# Altium project PCB_Project.PrjPcb (part 2 of 2)

## Sheet FPGA-Connector.SchDoc
size A2; Date: Date; CompanyName: HESSO; Engineer: Name; Address1: Route du Rawyl 47; Address2: 1950 Sion; Address3: Switzerland; ProjectName: Project Name
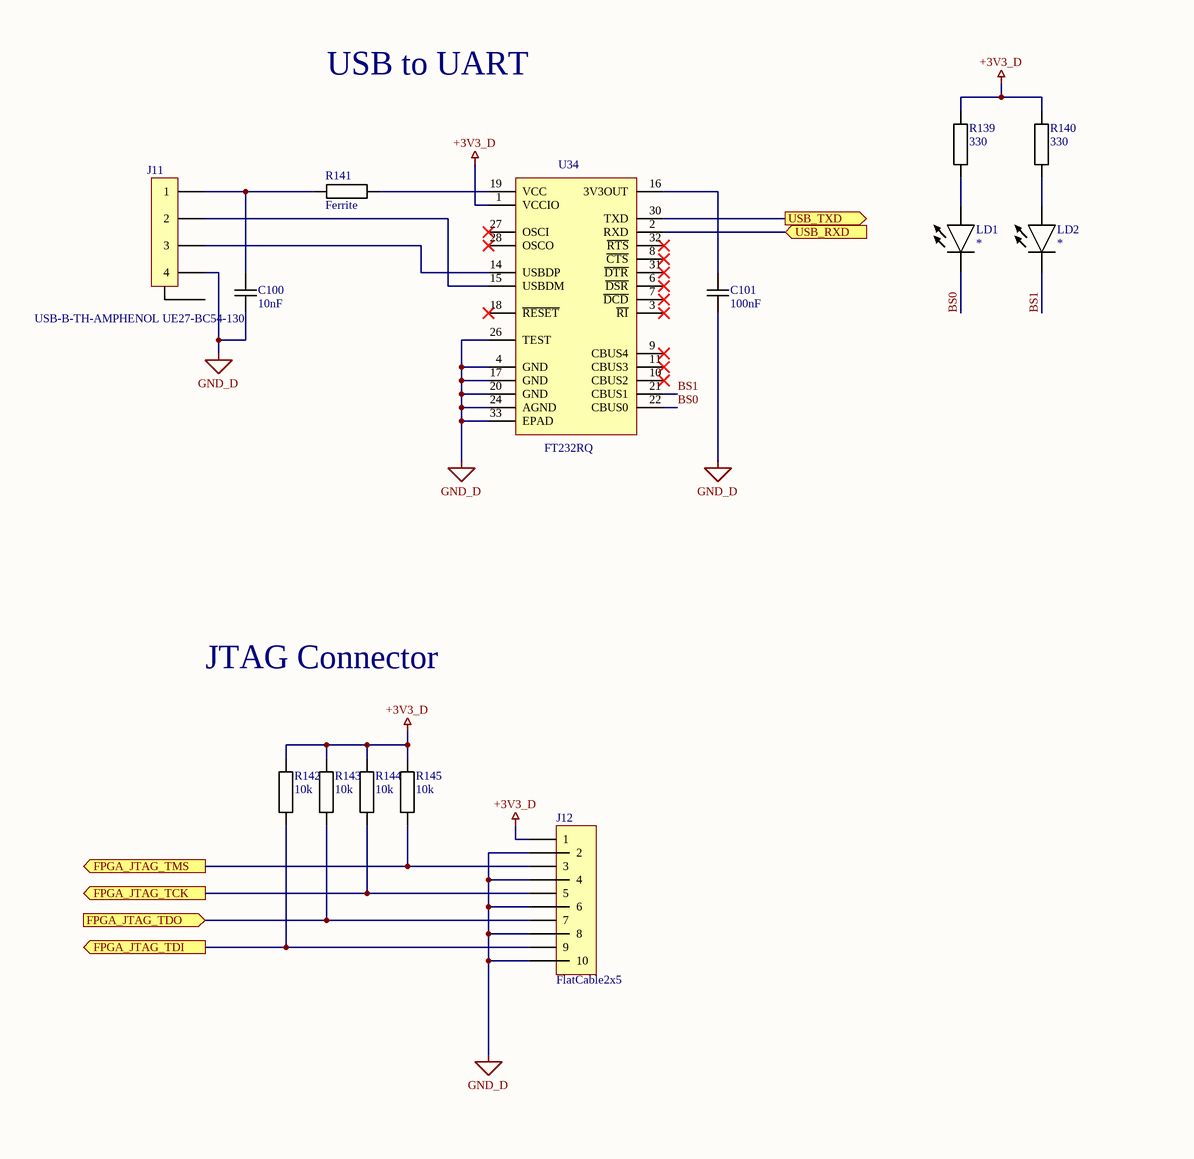
[diagram p10: FPGA-Connector.SchDoc, left]
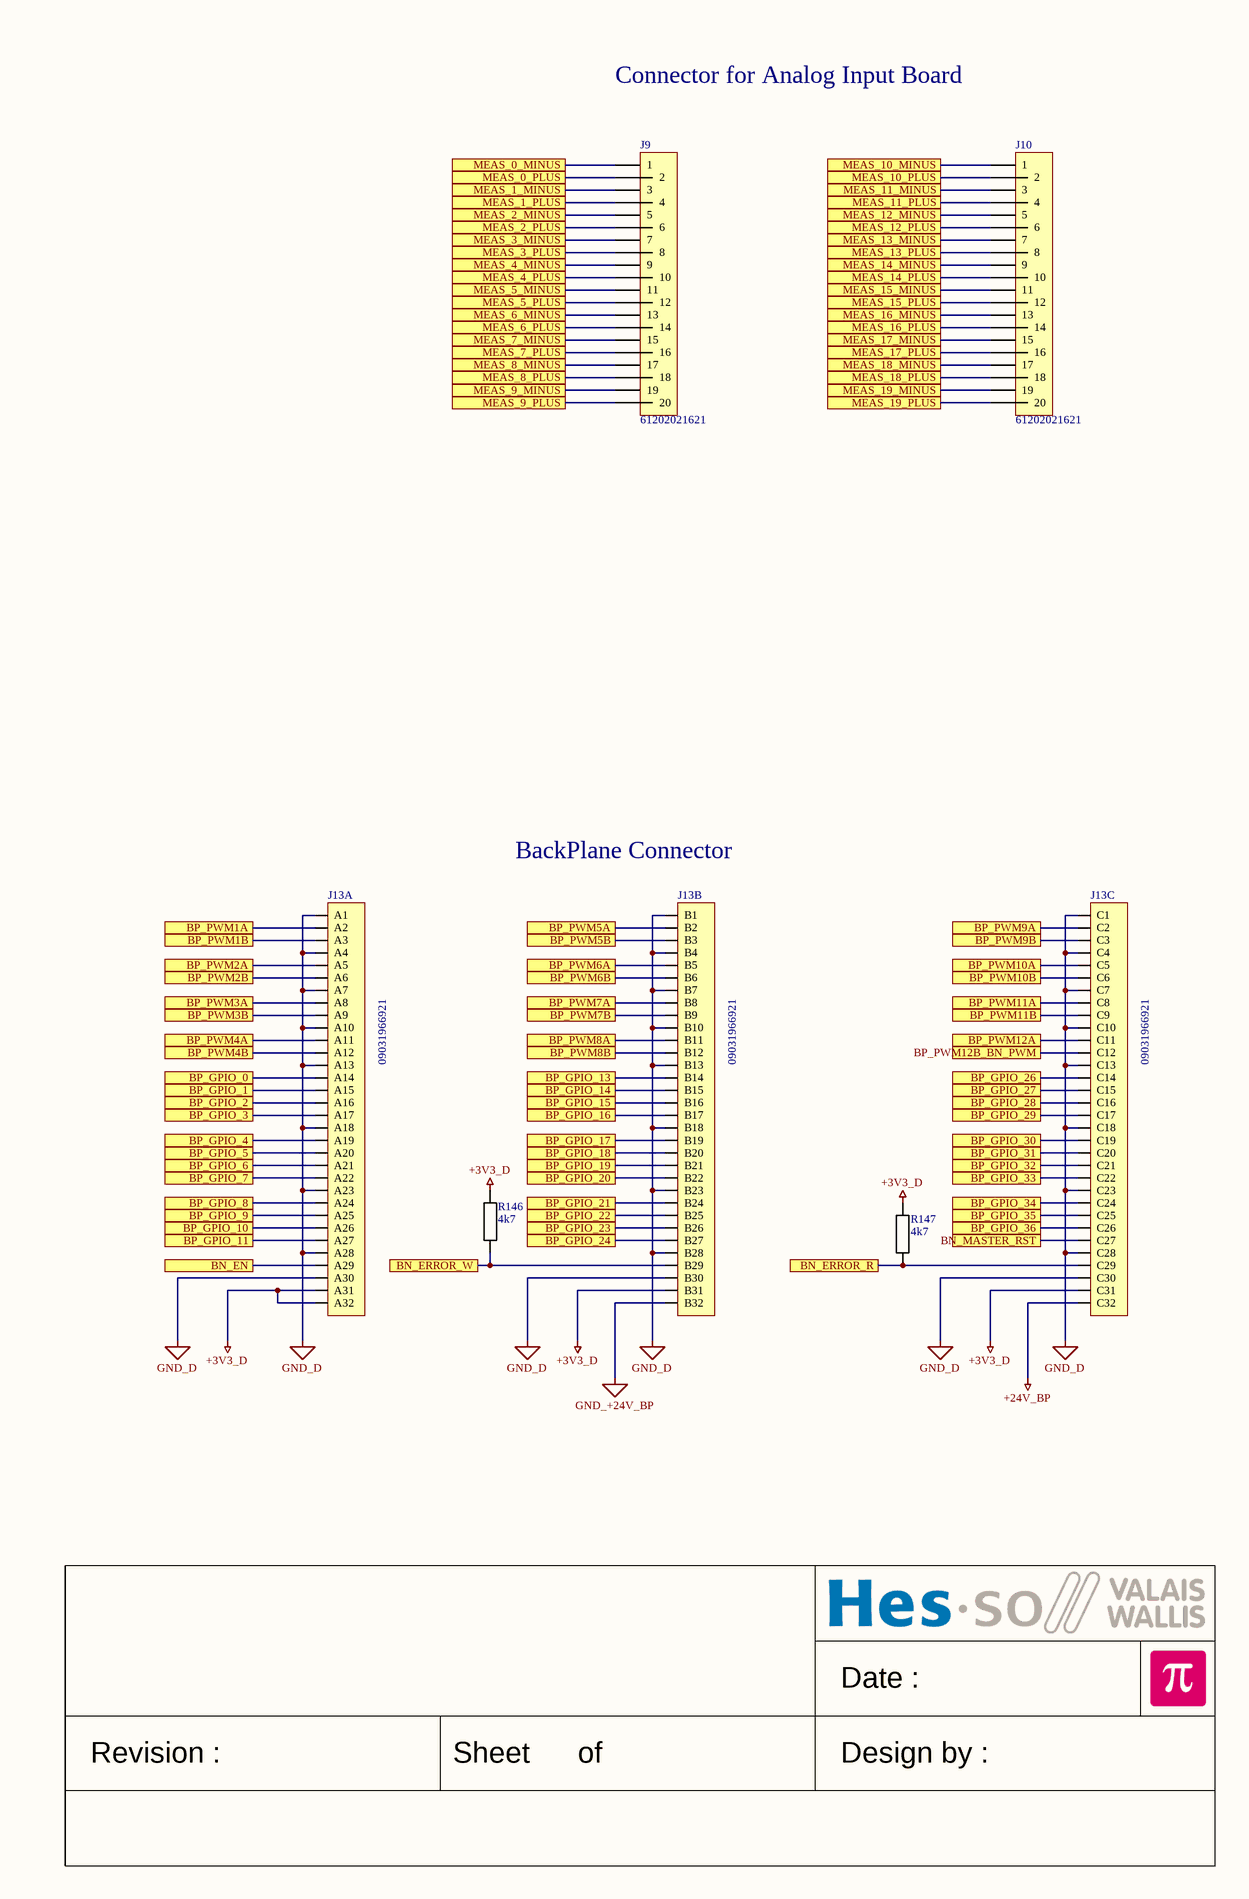
[diagram p11: FPGA-Connector.SchDoc, right]

### Parts
C100  10nF  [CAPACITOR 1608 REFLOW]
C101  100nF  [CAPACITOR 1608 REFLOW]
J9  61202021621  [FlatCable2x10 2.54MM Straight TH]
J10  61202021621  [FlatCable2x10 2.54MM Straight TH]
J11  USB-B-TH-AMPHENOL UE27-BC54-130  [USB-B TH AMPHENOL UE27-BC54-130]
J12  FlatCable2x5  [FlatCable2x5 2MM Straight TH FCI 98414-G06-10ULF]
J13  09031966921  [DIN41612 MALE 3X32 ABC R90]  (parts A,B,C of 3)
LD1  *  [LED 1608 REFLOW]
LD2  *  [LED 1608 REFLOW]
R139  330  [RESISTOR 2012 REFLOW]
R140  330  [RESISTOR 2012 REFLOW]
R141  Ferrite  [RESISTOR 1608 REFLOW]
R142  10k  [RESISTOR 1608 REFLOW]
R143  10k  [RESISTOR 1608 REFLOW]
R144  10k  [RESISTOR 1608 REFLOW]
R145  10k  [RESISTOR 1608 REFLOW]
R146  4k7  [RESISTOR 1608 REFLOW]
R147  4k7  [RESISTOR 1608 REFLOW]
U34  FT232RQ  [QFN32 P0.5 T3.2x3.2 C5.0X5.0 H1.0]

### Ports
BN_EN, BN_ERROR_R, BN_ERROR_W, BN_MASTER_RST, BP_GPIO_0, BP_GPIO_1, BP_GPIO_2, BP_GPIO_3, BP_GPIO_4, BP_GPIO_5, BP_GPIO_6, BP_GPIO_7, BP_GPIO_8, BP_GPIO_9, BP_GPIO_10, BP_GPIO_11, BP_GPIO_13, BP_GPIO_14, BP_GPIO_15, BP_GPIO_16, BP_GPIO_17, BP_GPIO_18, BP_GPIO_19, BP_GPIO_20, BP_GPIO_21, BP_GPIO_22, BP_GPIO_23, BP_GPIO_24, BP_GPIO_26, BP_GPIO_27, BP_GPIO_28, BP_GPIO_29, BP_GPIO_30, BP_GPIO_31, BP_GPIO_32, BP_GPIO_33, BP_GPIO_34, BP_GPIO_35, BP_GPIO_36, BP_PWM1A, BP_PWM1B, BP_PWM2A, BP_PWM2B, BP_PWM3A, BP_PWM3B, BP_PWM4A, BP_PWM4B, BP_PWM5A, BP_PWM5B, BP_PWM6A, BP_PWM6B, BP_PWM7A, BP_PWM7B, BP_PWM8A, BP_PWM8B, BP_PWM9A, BP_PWM9B, BP_PWM10A, BP_PWM10B, BP_PWM11A, BP_PWM11B, BP_PWM12A, BP_PWM12B_BN_PWM, FPGA_JTAG_TCK (out), FPGA_JTAG_TDI (out), FPGA_JTAG_TDO (in), FPGA_JTAG_TMS (out), MEAS_0_MINUS, MEAS_0_PLUS, MEAS_1_MINUS, MEAS_1_PLUS, MEAS_2_MINUS, MEAS_2_PLUS, MEAS_3_MINUS, MEAS_3_PLUS, MEAS_4_MINUS, MEAS_4_PLUS, MEAS_5_MINUS, MEAS_5_PLUS, MEAS_6_MINUS, MEAS_6_PLUS, MEAS_7_MINUS, MEAS_7_PLUS, MEAS_8_MINUS, MEAS_8_PLUS, MEAS_9_MINUS, MEAS_9_PLUS, MEAS_10_MINUS, MEAS_10_PLUS, MEAS_11_MINUS, MEAS_11_PLUS, MEAS_12_MINUS, MEAS_12_PLUS, MEAS_13_MINUS, MEAS_13_PLUS, MEAS_14_MINUS, MEAS_14_PLUS, MEAS_15_MINUS, MEAS_15_PLUS, MEAS_16_MINUS, MEAS_16_PLUS, MEAS_17_MINUS, MEAS_17_PLUS, MEAS_18_MINUS, MEAS_18_PLUS, MEAS_19_MINUS, MEAS_19_PLUS, USB_RXD (in), USB_TXD (out)

### Nets
+3V3_D: J12.1 J13.A31 J13.A32 J13.B31 J13.C31 R139.2 R140.2 R142.2 R143.2 R144.2 R145.2 R146.2 R147.2 U34.1(VCCIO)
+24V_BP: J13.C32
GND_+24V_BP: J13.B32
GND_D: C100.1 C101.1 J11.4 J12.2 J12.4 J12.6 J12.8 J12.10 J13.A1 J13.A4 J13.A7 J13.A10 J13.A13 J13.A18 J13.A23 J13.A28 J13.A30 J13.B1 J13.B4 J13.B7 J13.B10 J13.B13 J13.B18 J13.B23 J13.B28 J13.B30 J13.C1 J13.C4 J13.C7 J13.C10 J13.C13 J13.C18 J13.C23 J13.C28 J13.C30 U34.4(GND) U34.17(GND) U34.20(GND) U34.24(AGND) U34.26(TEST) U34.33(EPAD)
BS0: LD1.1(C) U34.22(CBUS0)
BS1: LD2.1(C) U34.21(CBUS1)
NetC100_2: C100.2 J11.1 R141.1
NetC101_2: C101.2 U34.16(3V3OUT)
NetJ9_1: J9.1 ; port MEAS_0_MINUS
NetJ9_2: J9.2 ; port MEAS_0_PLUS
NetJ9_3: J9.3 ; port MEAS_1_MINUS
NetJ9_4: J9.4 ; port MEAS_1_PLUS
NetJ9_5: J9.5 ; port MEAS_2_MINUS
NetJ9_6: J9.6 ; port MEAS_2_PLUS
NetJ9_7: J9.7 ; port MEAS_3_MINUS
NetJ9_8: J9.8 ; port MEAS_3_PLUS
NetJ9_9: J9.9 ; port MEAS_4_MINUS
NetJ9_10: J9.10 ; port MEAS_4_PLUS
NetJ9_11: J9.11 ; port MEAS_5_MINUS
NetJ9_12: J9.12 ; port MEAS_5_PLUS
NetJ9_13: J9.13 ; port MEAS_6_MINUS
NetJ9_14: J9.14 ; port MEAS_6_PLUS
NetJ9_15: J9.15 ; port MEAS_7_MINUS
NetJ9_16: J9.16 ; port MEAS_7_PLUS
NetJ9_17: J9.17 ; port MEAS_8_MINUS
NetJ9_18: J9.18 ; port MEAS_8_PLUS
NetJ9_19: J9.19 ; port MEAS_9_MINUS
NetJ9_20: J9.20 ; port MEAS_9_PLUS
NetJ10_1: J10.1 ; port MEAS_10_MINUS
NetJ10_2: J10.2 ; port MEAS_10_PLUS
NetJ10_3: J10.3 ; port MEAS_11_MINUS
NetJ10_4: J10.4 ; port MEAS_11_PLUS
NetJ10_5: J10.5 ; port MEAS_12_MINUS
NetJ10_6: J10.6 ; port MEAS_12_PLUS
NetJ10_7: J10.7 ; port MEAS_13_MINUS
NetJ10_8: J10.8 ; port MEAS_13_PLUS
NetJ10_9: J10.9 ; port MEAS_14_MINUS
NetJ10_10: J10.10 ; port MEAS_14_PLUS
NetJ10_11: J10.11 ; port MEAS_15_MINUS
NetJ10_12: J10.12 ; port MEAS_15_PLUS
NetJ10_13: J10.13 ; port MEAS_16_MINUS
NetJ10_14: J10.14 ; port MEAS_16_PLUS
NetJ10_15: J10.15 ; port MEAS_17_MINUS
NetJ10_16: J10.16 ; port MEAS_17_PLUS
NetJ10_17: J10.17 ; port MEAS_18_MINUS
NetJ10_18: J10.18 ; port MEAS_18_PLUS
NetJ10_19: J10.19 ; port MEAS_19_MINUS
NetJ10_20: J10.20 ; port MEAS_19_PLUS
NetJ11_2: J11.2 U34.15(USBDM)
NetJ11_3: J11.3 U34.14(USBDP)
NetJ11_5: J11.5 J11.6
NetJ12_3: J12.3 R145.1 ; port FPGA_JTAG_TMS
NetJ12_5: J12.5 R144.1 ; port FPGA_JTAG_TCK
NetJ12_7: J12.7 R143.1 ; port FPGA_JTAG_TDO
NetJ12_9: J12.9 R142.1 ; port FPGA_JTAG_TDI
NetJ13_A2: J13.A2 ; port BP_PWM1A
NetJ13_A3: J13.A3 ; port BP_PWM1B
NetJ13_A5: J13.A5 ; port BP_PWM2A
NetJ13_A6: J13.A6 ; port BP_PWM2B
NetJ13_A8: J13.A8 ; port BP_PWM3A
NetJ13_A9: J13.A9 ; port BP_PWM3B
NetJ13_A11: J13.A11 ; port BP_PWM4A
NetJ13_A12: J13.A12 ; port BP_PWM4B
NetJ13_A14: J13.A14 ; port BP_GPIO_0
NetJ13_A15: J13.A15 ; port BP_GPIO_1
NetJ13_A16: J13.A16 ; port BP_GPIO_2
NetJ13_A17: J13.A17 ; port BP_GPIO_3
NetJ13_A19: J13.A19 ; port BP_GPIO_4
NetJ13_A20: J13.A20 ; port BP_GPIO_5
NetJ13_A21: J13.A21 ; port BP_GPIO_6
NetJ13_A22: J13.A22 ; port BP_GPIO_7
NetJ13_A24: J13.A24 ; port BP_GPIO_8
NetJ13_A25: J13.A25 ; port BP_GPIO_9
NetJ13_A26: J13.A26 ; port BP_GPIO_10
NetJ13_A27: J13.A27 ; port BP_GPIO_11
NetJ13_A29: J13.A29 ; port BN_EN
NetJ13_B2: J13.B2 ; port BP_PWM5A
NetJ13_B3: J13.B3 ; port BP_PWM5B
NetJ13_B5: J13.B5 ; port BP_PWM6A
NetJ13_B6: J13.B6 ; port BP_PWM6B
NetJ13_B8: J13.B8 ; port BP_PWM7A
NetJ13_B9: J13.B9 ; port BP_PWM7B
NetJ13_B11: J13.B11 ; port BP_PWM8A
NetJ13_B12: J13.B12 ; port BP_PWM8B
NetJ13_B14: J13.B14 ; port BP_GPIO_13
NetJ13_B15: J13.B15 ; port BP_GPIO_14
NetJ13_B16: J13.B16 ; port BP_GPIO_15
NetJ13_B17: J13.B17 ; port BP_GPIO_16
NetJ13_B19: J13.B19 ; port BP_GPIO_17
NetJ13_B20: J13.B20 ; port BP_GPIO_18
NetJ13_B21: J13.B21 ; port BP_GPIO_19
NetJ13_B22: J13.B22 ; port BP_GPIO_20
NetJ13_B24: J13.B24 ; port BP_GPIO_21
NetJ13_B25: J13.B25 ; port BP_GPIO_22
NetJ13_B26: J13.B26 ; port BP_GPIO_23
NetJ13_B27: J13.B27 ; port BP_GPIO_24
NetJ13_B29: J13.B29 R146.1 ; port BN_ERROR_W
NetJ13_C2: J13.C2 ; port BP_PWM9A
NetJ13_C3: J13.C3 ; port BP_PWM9B
NetJ13_C5: J13.C5 ; port BP_PWM10A
NetJ13_C6: J13.C6 ; port BP_PWM10B
NetJ13_C8: J13.C8 ; port BP_PWM11A
NetJ13_C9: J13.C9 ; port BP_PWM11B
NetJ13_C11: J13.C11 ; port BP_PWM12A
NetJ13_C12: J13.C12 ; port BP_PWM12B_BN_PWM
NetJ13_C14: J13.C14 ; port BP_GPIO_26
NetJ13_C15: J13.C15 ; port BP_GPIO_27
NetJ13_C16: J13.C16 ; port BP_GPIO_28
NetJ13_C17: J13.C17 ; port BP_GPIO_29
NetJ13_C19: J13.C19 ; port BP_GPIO_30
NetJ13_C20: J13.C20 ; port BP_GPIO_31
NetJ13_C21: J13.C21 ; port BP_GPIO_32
NetJ13_C22: J13.C22 ; port BP_GPIO_33
NetJ13_C24: J13.C24 ; port BP_GPIO_34
NetJ13_C25: J13.C25 ; port BP_GPIO_35
NetJ13_C26: J13.C26 ; port BP_GPIO_36
NetJ13_C27: J13.C27 ; port BN_MASTER_RST
NetJ13_C29: J13.C29 R147.1 ; port BN_ERROR_R
NetLD1_2: LD1.2(A) R139.1
NetLD2_2: LD2.2(A) R140.1
NetR141_2: R141.2 U34.19(VCC)
NetU34_2: U34.2(RXD) ; port USB_RXD
NetU34_30: U34.30(TXD) ; port USB_TXD

Not connected (* = marked no-connect by the designer): U34 3(~{RI})* 5 6(~{DSR})* 7(~{DCD})* 8(~{CTS})* 9(CBUS4)* 10(CBUS2)* 11(CBUS3)* 12 13 18(~{RESET})* 23 25 27(OSCI)* 28(OSCO)* 29 31(~{DTR})* 32(~{RTS})*

### Notes on the sheet
- USB to UART
- Connector for Analog Input Board
- JTAG Connector
- BackPlane Connector
- Date :
- Revision :
- Sheet
- of
- Design by :

### Library data of the parts
C100 C101 = Capacitor: Capacitor X7R 10% 50V 1608(0603)
  C100: Value: 10nF
  C101: Value: 100nF
J9 J10 = FlatCable2x10: Manufacturer: Wurth Elektronik; Mouser No.: 710-61202021621; Value: 61202021621
J13 = DIN41612 MALE 3X32 ABC R90: Manufacturer: Harting; Mouser No.: 617-09-03-196-6921; Value: 09031966921
LD1 LD2 = LED: LED generic; Value: *
R139 R140 = Resistor: Resistor 1% 50V 125mW 2012(0805); Value: 330
R141-R147 = Resistor: Resistor 1% 50V 100mW 1608(0603)
  R141: Value: Ferrite
  R142-R145: Value: 10k
  R146 R147: Value: 4k7
U34 = FT232RQ: 24-Bit ADC with Ultra Low Noise PGIA - Crystal; Value: FT232RQ

## Sheet FPGA-Supply.SchDoc
size A2; Date: Date; CompanyName: HESSO; Engineer: Name; Address1: Route du Rawyl 47; Address2: 1950 Sion; Address3: Switzerland; ProjectName: Project Name
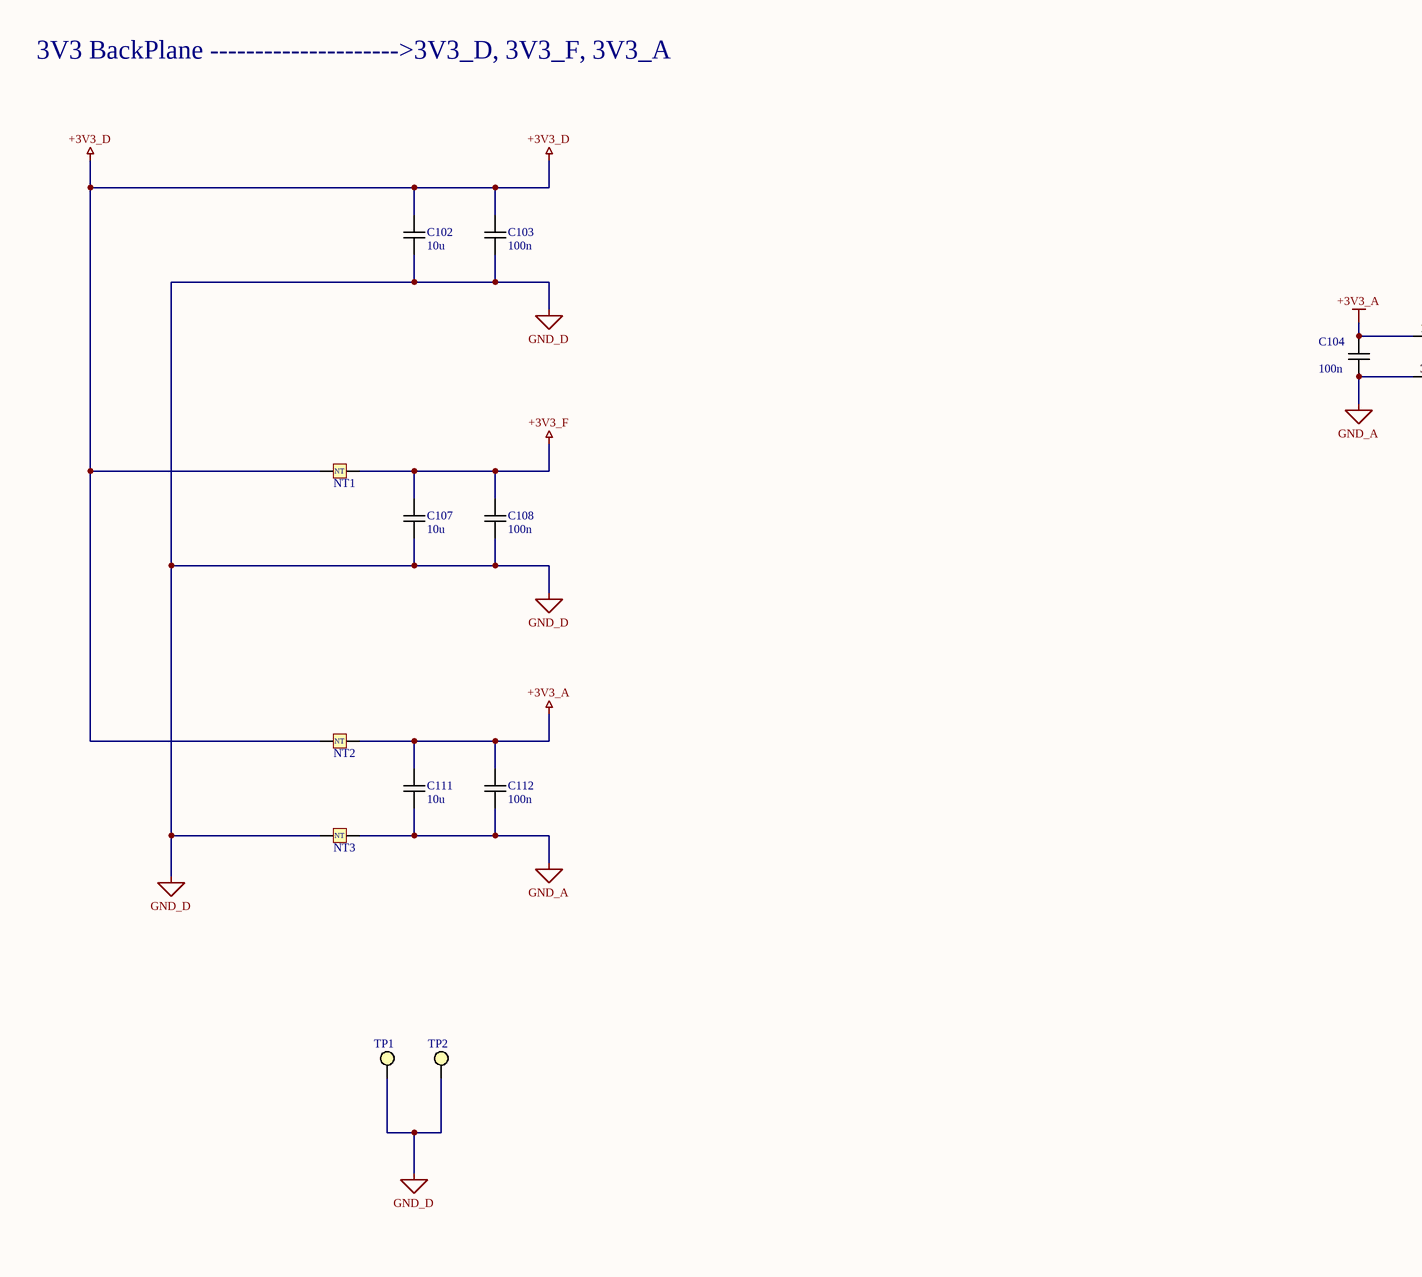
[diagram p12: FPGA-Supply.SchDoc, left]
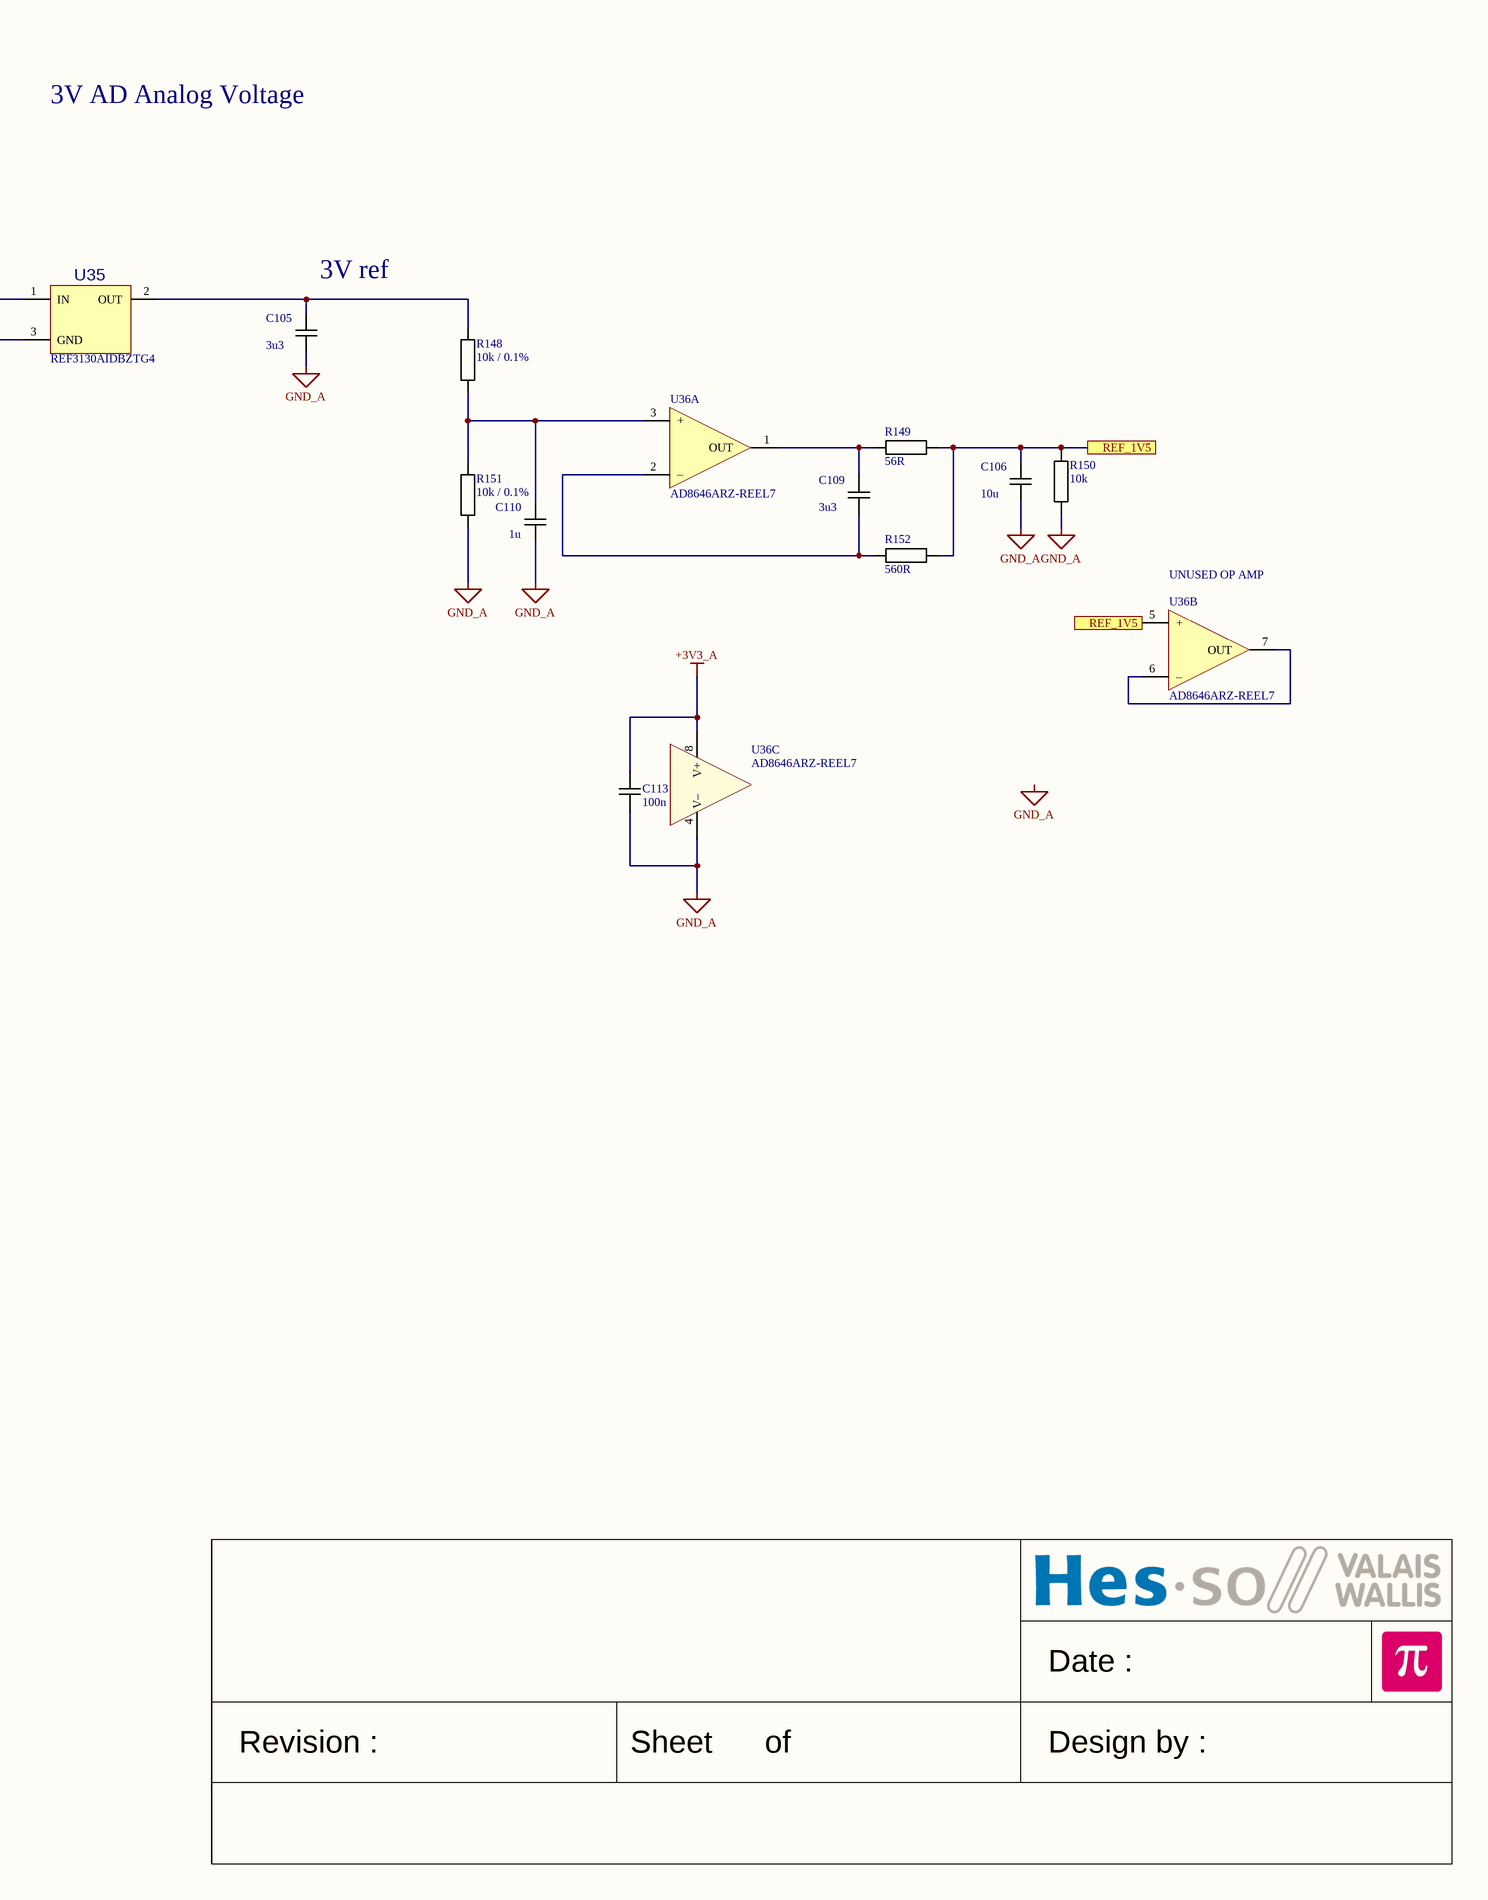
[diagram p13: FPGA-Supply.SchDoc, right]

### Parts
C102  10u  [CAPACITOR 2012 REFLOW]
C103  100n  [CAPACITOR 2012 REFLOW]
C104  100n  [CAPACITOR 1608 REFLOW]
C105  3u3  [CAPACITOR 2012 REFLOW]
C106  10u  [CAPACITOR 2012 REFLOW]
C107  10u  [CAPACITOR 2012 REFLOW]
C108  100n  [CAPACITOR 2012 REFLOW]
C109  3u3  [CAPACITOR 2012 REFLOW]
C110  1u  [CAPACITOR 2012 REFLOW]
C111  10u  [CAPACITOR 2012 REFLOW]
C112  100n  [CAPACITOR 2012 REFLOW]
C113  100n  [CAPACITOR 1608 REFLOW]
NT1  Net Tie  [NET TIE 1005]  (value not drawn)  (net tie, no BOM)
NT2  Net Tie  [NET TIE 1005]  (value not drawn)  (net tie, no BOM)
NT3  Net Tie  [NET TIE 1005]  (value not drawn)  (net tie, no BOM)
R148  10k / 0.1%  [RESISTOR 1608 REFLOW]
R149  56R  [RESISTOR 1608 REFLOW]
R150  10k  [RESISTOR 1608 REFLOW]
R151  10k / 0.1%  [RESISTOR 1608 REFLOW]
R152  560R  [RESISTOR 1608 REFLOW]
TP1  *  [Test Point Keystone Miniature BLACK]  (value not drawn)
TP2  *  [Test Point Keystone Miniature BLACK]  (value not drawn)
U35  REF3130AIDBZTG4  [SOT23 P0.95 C1.6x3.0 H1.3]
U36  AD8646ARZ-REEL7  [SO8 P1.27 C4.0X5.0 H1.75]  (parts A,B,C of 3)

### Ports
REF_1V5

### Nets
+3V3_A: C104.2 C111.1 C112.1 C113.2 NT2.2 U35.1(IN) U36.8(V+)
+3V3_D: C102.1 C103.1 NT1.1 NT2.1
+3V3_F: C107.1 C108.1 NT1.2
GND_A: C104.1 C105.1 C106.1 C110.1 C111.2 C112.2 C113.1 NT3.2 R150.2 R151.2 U35.3(GND) U36.4(V–)
GND_D: C102.2 C103.2 C107.2 C108.2 NT3.1 TP1.1 TP2.1
NetC105_2: C105.2 R148.2 U35.2(OUT)
NetC106_2: C106.2 R149.1 R150.1 R152.1 U36.5(+) ; port REF_1V5
NetC109_1: C109.1 R152.2 U36.2(–)
NetC109_2: C109.2 R149.2 U36.1(OUT)
NetC110_2: C110.2 R148.1 R151.1 U36.3(+)
NetU36_6: U36.6(–) U36.7(OUT)

### Notes on the sheet
- 3V3 BackPlane --------------------->3V3_D, 3V3_F, 3V3_A
- 3V AD Analog Voltage
- (near C105) 3V ref
- (near U36) UNUSED OP AMP
- Date :
- Revision :
- Sheet
- of
- Design by :
- Labels drawn without touching a wire or pin: GND_A
- (in symbol Net Tie) NT

### Library data of the parts
C102 C105-C107 C109-C111 = Capacitor: Capacitor X7R 10% 10V 2012(0805)
  C102 C106 C107 C111: Value: 10u
  C105 C109: Value: 3u3
  C110: Value: 1u
C103 C108 C112 = Capacitor: Capacitor X7R 10% 50V 2012(0805); Value: 100n
C104 C113 = Capacitor: Capacitor X7R 10% 50V 1608(0603); Value: 100n
NT1-NT3 = Net Tie: Connection for 2 different NETNAME
R148-R152 = Resistor: Resistor 1% 50V 100mW 1608(0603)
  R148 R151: Value: 10k / 0.1%
  R149: Value: 56R
  R150: Value: 10k
  R152: Value: 560R
TP1 TP2 = Test Point: Value: *
U35 = REFERENCE SOT23 IN-OUT- GND: Generic Positive Voltage Reference; Manufacturer: Texas Instruments; Value: REF3130AIDBZTG4; Mouser No.: 595-REF3130AIDBZTG4
U36 = OPA DUAL: Generic dual OPA 8 pins; Manufacturer: Analog Devices; Value: AD8646ARZ-REEL7; Mouser No.: 584-AD8646ARZ-R7

## Nets that join several sheets
+3V3_D: FPGA (67 pins), FPGA-8 (6 pins), FPGA-7 (6 pins), FPGA-Connector (14 pins), FPGA-Supply (C102.1 C103.1 NT1.1 NT2.1)
+24V_BP: FPGA-6 (C71.2 U24.2), FPGA-Connector (J13.C32)
GND_A: FPGA-1 (16 pins), FPGA-2 (16 pins), FPGA-3 (16 pins), FPGA-4 (16 pins), FPGA-5 (16 pins), FPGA-6 (32 pins), FPGA-Supply (12 pins)
GND_D: FPGA (70 pins), FPGA-8 (15 pins), FPGA-7 (15 pins), FPGA-Connector (41 pins), FPGA-Supply (7 pins)
NetC3_2: FPGA-1 (C3.2 R1.2 R7.2 R11.1), FPGA-6 (U12.3)
NetC4_2: FPGA-1 (C4.2 R2.2 R8.2 R12.1), FPGA-6 (U6.3)
NetC9_2: FPGA-1 (C9.2 R17.2 R23.2 R27.1), FPGA-6 (U15.3)
NetC10_2: FPGA-1 (C10.2 R19.2 R24.2 R29.1), FPGA-6 (U9.3)
NetC16_2: FPGA-2 (C16.2 R33.2 R39.2 R43.1), FPGA-6 (U25.3)
NetC17_2: FPGA-2 (C17.2 R34.2 R40.2 R44.1), FPGA-6 (U18.3)
NetC22_2: FPGA-2 (C22.2 R49.2 R55.2 R59.1), FPGA-6 (U26.3)
NetC23_2: FPGA-2 (C23.2 R51.2 R56.2 R61.1), FPGA-6 (U21.3)
NetC29_2: FPGA-3 (C29.2 R65.2 R71.2 R75#1.1), FPGA-6 (U10.3)
NetC30_2: FPGA-3 (C30.2 R66.2 R72.2 R76#1.1), FPGA-6 (U27.3)
NetC35_2: FPGA-3 (C35.2 R81#1.2 R87#1.2 R91#1.1), FPGA-6 (U13.3)
NetC36_2: FPGA-3 (C36.2 R83#1.2 R88#1.2 R93#1.1), FPGA-6 (U7.3)
NetC42_2: FPGA-4 (C42.2 R73#2.2 R77.2 R81#2.1), FPGA-6 (U22.3)
NetC43_2: FPGA-4 (C43.2 R74#2.2 R78.2 R82.1), FPGA-6 (U16.3)
NetC48_2: FPGA-4 (C48.2 R85#2.2 R89#2.2 R93#2.1), FPGA-6 (U8.3)
NetC49_2: FPGA-4 (C49.2 R86#2.2 R90#2.2 R94.1), FPGA-6 (U19.3)
NetC55_2: FPGA-5 (C55.2 R97.2 R101.2 R105.1), FPGA-6 (U17.3)
NetC56_2: FPGA-5 (C56.2 R98.2 R102.2 R106.1), FPGA-6 (U11.3)
NetC61_2: FPGA-5 (C61.2 R109.2 R113.2 R117.1), FPGA-6 (U20.3)
NetC62_2: FPGA-5 (C62.2 R110.2 R114.2 R118.1), FPGA-6 (U14.3)
NetC106_2: FPGA-1 (JP?#1.1 JP?#2.1 JP?#3.1 JP?#4.1), FPGA-2 (JP?#5.1 JP?#6.1 JP?#7.1 JP?#8.1), FPGA-3 (JP?#9.1 JP?#10.1 JP?#11.1 JP?#12.1), FPGA-4 (JP13.1 JP14.1 JP15.1 JP16.1), FPGA-5 (JP17.1 JP18.1 JP19.1 JP20.1), FPGA-Supply (5 pins)
NetC?#1_2: FPGA-8 (C?#1.2 J?#1.1 U?#1.1 U?#1.2), FPGA-7 (C?#13.2 J?#5.1 U?#8.1 U?#8.2)
NetC?#3_2: FPGA-8 (C?#3.2 J?#2.1 U?#3.6 U?#3.7), FPGA-7 (C?#15.2 J?#6.1 U?#10.6 U?#10.7)
NetC?#7_2: FPGA-8 (C?#7.2 J?#3.1 U?#5.8 U?#5.9), FPGA-7 (C?#19.2 J?#7.1 U?#12.8 U?#12.9)
NetC?#10_2: FPGA-8 (C?#10.2 J?#4.1 U?#6.13 U?#6.14), FPGA-7 (C?#22.2 J?#8.1 U?#13.13 U?#13.14)
NetJ9_3: FPGA-1 (R6.1), FPGA-Connector (J9.3)
NetJ9_4: FPGA-1 (R10.1), FPGA-Connector (J9.4)
NetJ9_5: FPGA-1 (R22.1), FPGA-Connector (J9.5)
NetJ9_6: FPGA-1 (R26.1), FPGA-Connector (J9.6)
NetJ9_7: FPGA-1 (R5.1), FPGA-Connector (J9.7)
NetJ9_8: FPGA-1 (R9.1), FPGA-Connector (J9.8)
NetJ9_9: FPGA-1 (R21.1), FPGA-Connector (J9.9)
NetJ9_10: FPGA-1 (R25.1), FPGA-Connector (J9.10)
NetJ9_11: FPGA-2 (R38.1), FPGA-Connector (J9.11)
NetJ9_12: FPGA-2 (R42.1), FPGA-Connector (J9.12)
NetJ9_13: FPGA-2 (R54.1), FPGA-Connector (J9.13)
NetJ9_14: FPGA-2 (R58.1), FPGA-Connector (J9.14)
NetJ9_15: FPGA-2 (R37.1), FPGA-Connector (J9.15)
NetJ9_16: FPGA-2 (R41.1), FPGA-Connector (J9.16)
NetJ9_17: FPGA-2 (R53.1), FPGA-Connector (J9.17)
NetJ9_18: FPGA-2 (R57.1), FPGA-Connector (J9.18)
NetJ9_19: FPGA-3 (R70.1), FPGA-Connector (J9.19)
NetJ9_20: FPGA-3 (R74#1.1), FPGA-Connector (J9.20)
NetJ10_1: FPGA-3 (R86#1.1), FPGA-Connector (J10.1)
NetJ10_2: FPGA-3 (R90#1.1), FPGA-Connector (J10.2)
NetJ10_3: FPGA-3 (R69.1), FPGA-Connector (J10.3)
NetJ10_4: FPGA-3 (R73#1.1), FPGA-Connector (J10.4)
NetJ10_5: FPGA-3 (R85#1.1), FPGA-Connector (J10.5)
NetJ10_6: FPGA-3 (R89#1.1), FPGA-Connector (J10.6)
NetJ10_7: FPGA-4 (R76#2.1), FPGA-Connector (J10.7)
NetJ10_8: FPGA-4 (R80#2.1), FPGA-Connector (J10.8)
NetJ10_9: FPGA-4 (R88#2.1), FPGA-Connector (J10.9)
NetJ10_10: FPGA-4 (R92.1), FPGA-5 (R104.1), FPGA-Connector (J10.10)
NetJ10_11: FPGA-4 (R75#2.1), FPGA-Connector (J10.11)
NetJ10_12: FPGA-4 (R79#2.1), FPGA-Connector (J10.12)
NetJ10_13: FPGA-4 (R87#2.1), FPGA-Connector (J10.13)
NetJ10_14: FPGA-4 (R91#2.1), FPGA-Connector (J10.14)
NetJ10_15: FPGA-5 (R100.1), FPGA-Connector (J10.15)
NetJ10_17: FPGA-5 (R112.1), FPGA-Connector (J10.17)
NetJ10_18: FPGA-5 (R116.1), FPGA-Connector (J10.18)
NetJ10_19: FPGA-5 (R99.1), FPGA-Connector (J10.19)
NetJ10_20: FPGA-5 (R103.1), FPGA-Connector (J10.20)
NetJ12_3: FPGA (U37.C18), FPGA-Connector (J12.3 R145.1)
NetJ12_5: FPGA (U37.G15), FPGA-Connector (J12.5 R144.1)
NetJ12_7: FPGA (U37.A19), FPGA-Connector (J12.7 R143.1)
NetJ12_9: FPGA (U37.E18), FPGA-Connector (J12.9 R142.1)
NetR?#1_1: FPGA-8 (R?#1.1 U?#2.2), FPGA-7 (R?#9.1 U?#9.2)
NetR?#3_1: FPGA-8 (R?#3.1 U?#2.3), FPGA-7 (R?#11.1 U?#9.3)
NetR?#5_1: FPGA-8 (R?#5.1 U?#2.4), FPGA-7 (R?#13.1 U?#9.4)
NetR?#7_1: FPGA-8 (R?#7.1 U?#2.5), FPGA-7 (R?#15.1 U?#9.5)
NetU?#2_8: FPGA-8 (U?#2.8), FPGA-7 (U?#9.8)
NetU?#2_9: FPGA-8 (U?#2.9), FPGA-7 (U?#9.9)
NetU?#2_10: FPGA-8 (U?#2.10), FPGA-7 (U?#9.10)